# Altium schematic sheet display-board.SchDoc
size A4; SheetNumber: 1; SheetTotal: 1
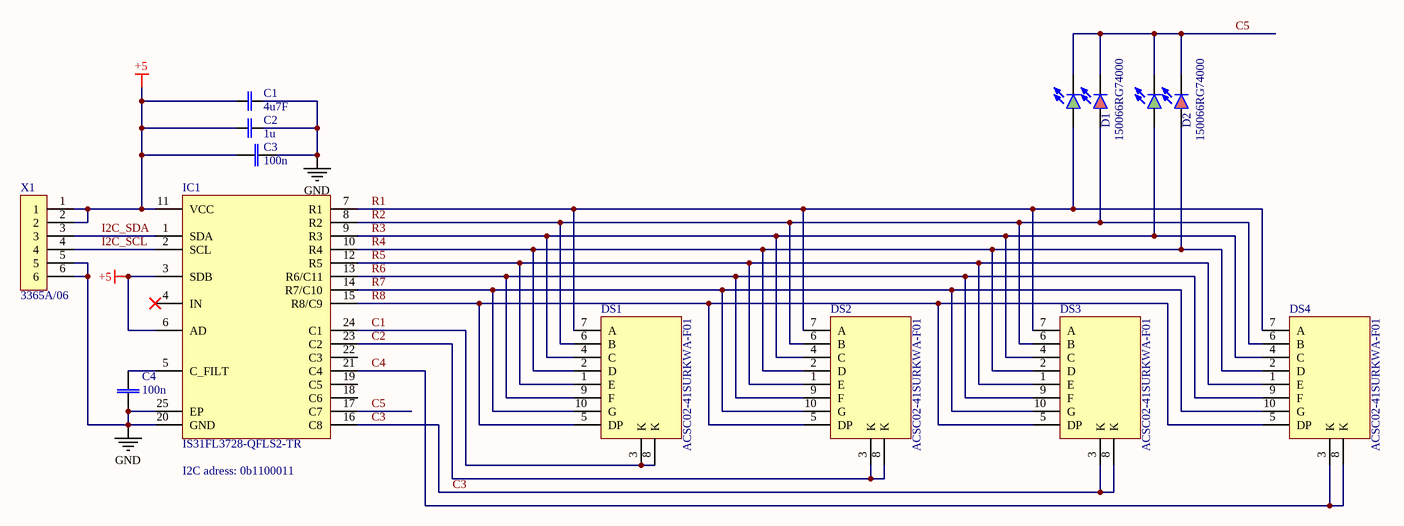
[diagram p0: display-board.SchDoc]

## Parts
C1  4u7F  [0805]
C2  1u  [0603]
C3  100n  [CAP0402]
C4  100n  [CAP0402]
D1  150066RG74000  [150066RG74000]
D2  150066RG74000  [150066RG74000]
DS1  ACSC02-41SURKWA-F01  [ACSC02-41SURKWA-F01]
DS2  ACSC02-41SURKWA-F01  [ACSC02-41SURKWA-F01]
DS3  ACSC02-41SURKWA-F01  [ACSC02-41SURKWA-F01]
DS4  ACSC02-41SURKWA-F01  [ACSC02-41SURKWA-F01]
IC1  IS31FL3728-QFLS2-TR  [QFN24_4X4(IS31FL3728)]
X1  3365A/06  [3M_CBL_RIBN_6X]

## Nets
+5: C1.2 C2.2 C3.2 IC1.3(SDB) IC1.6(AD) IC1.11(VCC) X1.1 X1.2
GND: C1.1 C2.1 C3.1 C4.2 IC1.20(GND) IC1.25(EP) X1.5 X1.6
C1: DS1.3(K) DS1.8(K) IC1.24(C1)
C2: DS2.3(K) DS2.8(K) IC1.23(C2)
C3: DS3.3(K) DS3.8(K) IC1.16(C8)
C4: DS4.3(K) DS4.8(K) IC1.21(C4)
C5: D1.1 D1.2 D2.1 D2.2 IC1.17(C7)
I2C_SCL: IC1.2(SCL) X1.4
I2C_SDA: IC1.1(SDA) X1.3
R1: D1.3 DS1.7(A) DS2.7(A) DS3.7(A) DS4.7(A) IC1.7(R1)
R2: D1.4 DS1.6(B) DS2.6(B) DS3.6(B) DS4.6(B) IC1.8(R2)
R3: D2.3 DS1.4(C) DS2.4(C) DS3.4(C) DS4.4(C) IC1.9(R3)
R4: D2.4 DS1.2(D) DS2.2(D) DS3.2(D) DS4.2(D) IC1.10(R4)
R5: DS1.1(E) DS2.1(E) DS3.1(E) DS4.1(E) IC1.12(R5)
R6: DS1.9(F) DS2.9(F) DS3.9(F) DS4.9(F) IC1.13(R6/C11)
R7: DS1.10(G) DS2.10(G) DS3.10(G) DS4.10(G) IC1.14(R7/C10)
R8: DS1.5(DP) DS2.5(DP) DS3.5(DP) DS4.5(DP) IC1.15(R8/C9)
NetC4_1: C4.1 IC1.5(C_FILT)

Not connected (* = marked no-connect by the designer): IC1 4(IN)* 18(C6) 19(C5) 22(C3)

## Notes on the sheet
- (near IC1) I2C adress: 0b1100011

## Library data of the parts
C1 = 000090: Part Number: 000090; Component Type: Standard; ComponentLink1Description: Datasheet; ComponentLink2Description: Manufacturer Site; Value: 4u7F; Digikey Number: 1276-1065-1-ND
C2 = 000088: Part Number: 000088; Component Type: Standard; ComponentLink1Description: Datasheet; ComponentLink2Description: Manufacturer Site; Value: 1u
C3 C4 = CL05A104KA5NNNC: MaxVoltage: 25V; Dialectric: X5R; Tolerance: 10%; Value: 100n; MPN: CL05A104KA5NNNC
D1 D2 = 150066RG74000: Grün, Rot 520nm Grün, 625nm Rot LED-Indikator - Diskret 3,2V Grün, 2V Rot 0606 (1616 metrisch)